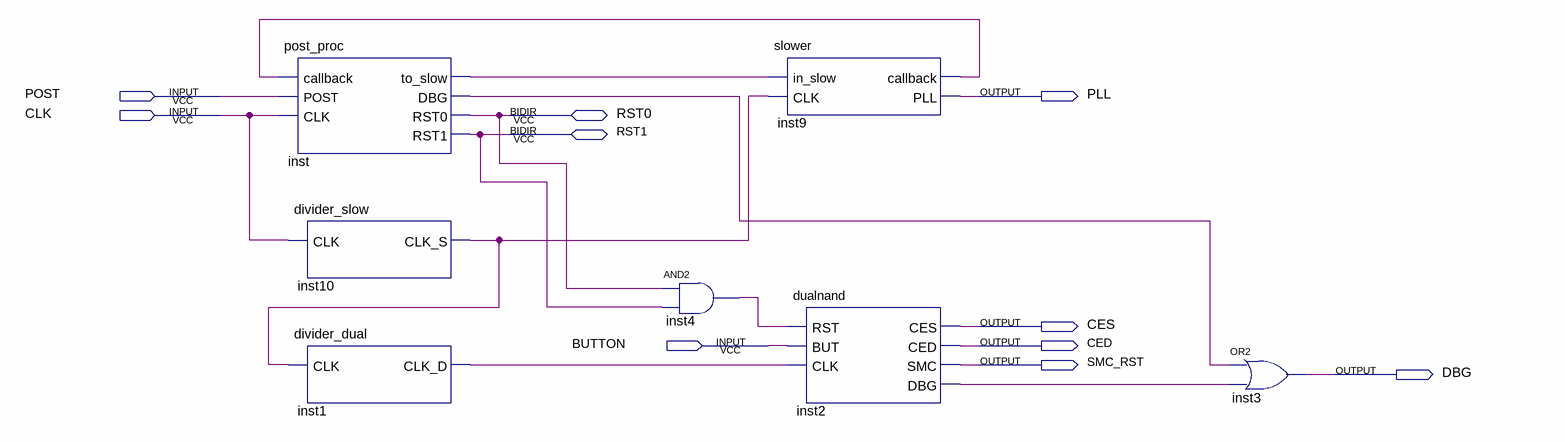
[diagram p0: schematic sheet]
// Quartus schematic glitchChip_dualnand.bdf as structural Verilog: 7 symbols, 10 pins
module glitchChip_dualnand (
  input  POST,
  input  CLK,
  input  BUTTON,
  inout  RST0,
  inout  RST1,
  output PLL,
  output CES,
  output CED,
  output SMC_RST,
  output DBG
);

  wire inst1_clk_d, inst2_dbg, inst4_out, inst9_callback, inst10_clk_s, inst_dbg, inst_to_slow;

  post_proc inst (
    .callback(inst9_callback), .POST(POST), .CLK(CLK), .to_slow(inst_to_slow), .DBG(inst_dbg), .RST0(RST0),
    .RST1(RST1));
  divider_slow inst10 (.CLK(CLK), .CLK_S(inst10_clk_s));
  divider_dual inst1 (.CLK(inst10_clk_s), .CLK_D(inst1_clk_d));
  and inst4 (inst4_out, RST0, RST1);
  slower inst9 (.in_slow(inst_to_slow), .CLK(inst10_clk_s), .callback(inst9_callback), .PLL(PLL));
  dualnand inst2 (
    .RST(inst4_out), .BUT(BUTTON), .CLK(inst1_clk_d), .CES(CES), .CED(CED), .SMC(SMC_RST), .DBG(inst2_dbg));
  or inst3 (DBG, inst_dbg, inst2_dbg);
endmodule
